# Altium schematic sheet SLT3-PAY-1Q2T_P1.SchDoc: SVPXFMC Carrier 3U
size A3; CheckedBy: \; Author: G.Kasprowicz; CompanyName: ISE; DrawnBy: T.Przywozki; Organization: WUT ISE; Address1: Warsaw University of Technology; Address2: Nowowiejska 15/19 00-665 Warsaw; Revision: 1.0.; SheetNumber: 13; SheetTotal: 20; Project: SVPXFMC Carrier 3U; ModifiedBy: -; CheckedDate: -; Title2: SpaceVPX P1, SLT3-PAY-1Q2T; DivGrp: ISE; Designer: G. Kasprowicz
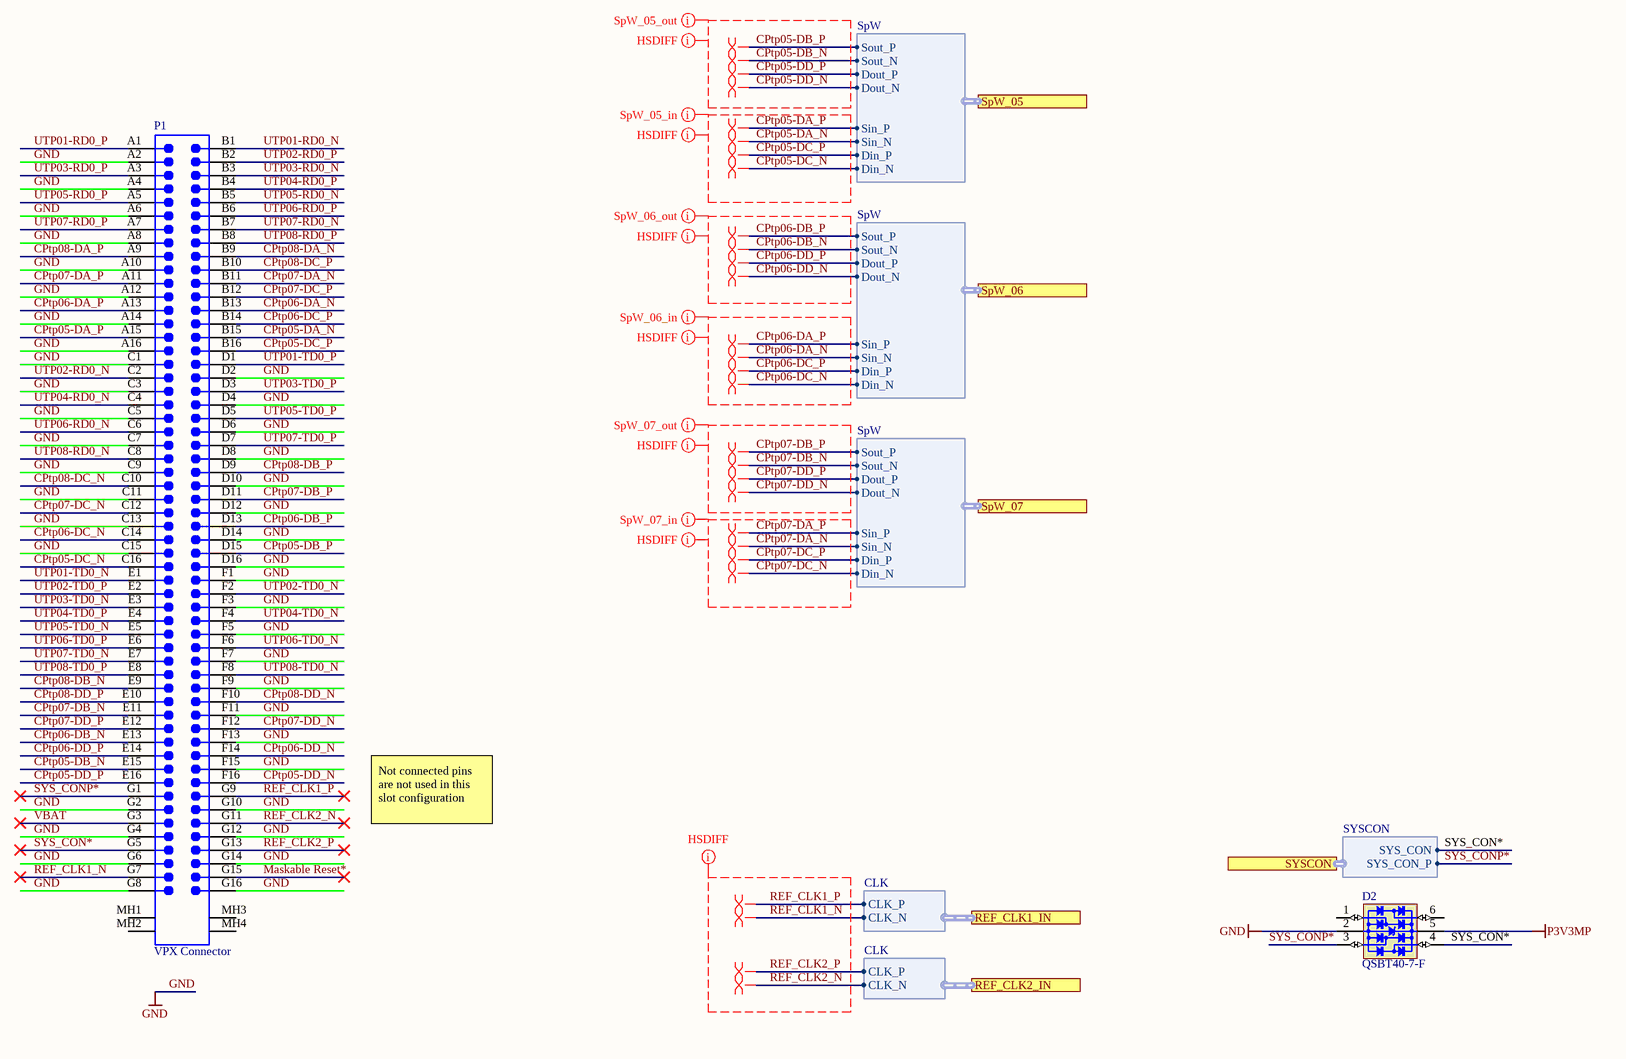
[diagram p0: SLT3-PAY-1Q2T_P1.SchDoc]

## Parts
D2  QSBT40-7-F  [SOT65P210X110-6N]
P1  VPX Connector  [BTB1-8-4H112M]

## Ports
REF_CLK1_IN (harness CLK), REF_CLK2_IN (harness CLK), SpW_05 (harness SpW), SpW_06 (harness SpW), SpW_07 (harness SpW), SYSCON (harness SYSCON)

## Harnesses
SpW: Sout_P, Sout_N, Dout_P, Dout_N, Sin_P, Sin_N, Din_P, Din_N
CLK: CLK_P, CLK_N
SYSCON: SYS_CON, SYS_CON_P

## Nets
GND: D2.2(GND) P1.A2 P1.A4 P1.A6 P1.A8 P1.A10 P1.A12 P1.A14 P1.A16 P1.C1 P1.C3 P1.C5 P1.C7 P1.C9 P1.C11 P1.C13 P1.C15 P1.D2 P1.D4 P1.D6 P1.D8 P1.D10 P1.D12 P1.D14 P1.D16 P1.F1 P1.F3 P1.F5 P1.F7 P1.F9 P1.F11 P1.F13 P1.F15 P1.G2 P1.G4 P1.G6 P1.G8 P1.G10 P1.G12 P1.G14 P1.G16
P3V3MP: D2.5(VBUS)
CPtp05-DA_N: P1.B15 ; port SpW_05.Sin_N
CPtp05-DA_P: P1.A15 ; port SpW_05.Sin_P
CPtp05-DB_N: P1.E15 ; port SpW_05.Sout_N
CPtp05-DB_P: P1.D15 ; port SpW_05.Sout_P
CPtp05-DC_N: P1.C16 ; port SpW_05.Din_N
CPtp05-DC_P: P1.B16 ; port SpW_05.Din_P
CPtp05-DD_N: P1.F16 ; port SpW_05.Dout_N
CPtp05-DD_P: P1.E16 ; port SpW_05.Dout_P
CPtp06-DA_N: P1.B13 ; port SpW_06.Sin_N
CPtp06-DA_P: P1.A13 ; port SpW_06.Sin_P
CPtp06-DB_N: P1.E13 ; port SpW_06.Sout_N
CPtp06-DB_P: P1.D13 ; port SpW_06.Sout_P
CPtp06-DC_N: P1.C14 ; port SpW_06.Din_N
CPtp06-DC_P: P1.B14 ; port SpW_06.Din_P
CPtp06-DD_N: P1.F14 ; port SpW_06.Dout_N
CPtp06-DD_P: P1.E14 ; port SpW_06.Dout_P
CPtp07-DA_N: P1.B11 ; port SpW_07.Sin_N
CPtp07-DA_P: P1.A11 ; port SpW_07.Sin_P
CPtp07-DB_N: P1.E11 ; port SpW_07.Sout_N
CPtp07-DB_P: P1.D11 ; port SpW_07.Sout_P
CPtp07-DC_N: P1.C12 ; port SpW_07.Din_N
CPtp07-DC_P: P1.B12 ; port SpW_07.Din_P
CPtp07-DD_N: P1.F12 ; port SpW_07.Dout_N
CPtp07-DD_P: P1.E12 ; port SpW_07.Dout_P
CPtp08-DA_N: P1.B9
CPtp08-DA_P: P1.A9
CPtp08-DB_N: P1.E9
CPtp08-DB_P: P1.D9
CPtp08-DC_N: P1.C10
CPtp08-DC_P: P1.B10
CPtp08-DD_N: P1.F10
CPtp08-DD_P: P1.E10
Maskable Reset*: P1.G15
REF_CLK1_N: P1.G7 ; port REF_CLK1_IN.CLK_N
REF_CLK1_P: P1.G9 ; port REF_CLK1_IN.CLK_P
REF_CLK2_N: P1.G11 ; port REF_CLK2_IN.CLK_N
REF_CLK2_P: P1.G13 ; port REF_CLK2_IN.CLK_P
SYS_CON*: D2.4(I/O3) P1.G5 ; port SYSCON.SYS_CON
SYS_CONP*: D2.3(I/O2) P1.G1 ; port SYSCON.SYS_CON_P
UTP01-RD0_N: P1.B1
UTP01-RD0_P: P1.A1
UTP01-TD0_N: P1.E1
UTP01-TD0_P: P1.D1
UTP02-RD0_N: P1.C2
UTP02-RD0_P: P1.B2
UTP02-TD0_N: P1.F2
UTP02-TD0_P: P1.E2
UTP03-RD0_N: P1.B3
UTP03-RD0_P: P1.A3
UTP03-TD0_N: P1.E3
UTP03-TD0_P: P1.D3
UTP04-RD0_N: P1.C4
UTP04-RD0_P: P1.B4
UTP04-TD0_N: P1.F4
UTP04-TD0_P: P1.E4
UTP05-RD0_N: P1.B5
UTP05-RD0_P: P1.A5
UTP05-TD0_N: P1.E5
UTP05-TD0_P: P1.D5
UTP06-RD0_N: P1.C6
UTP06-RD0_P: P1.B6
UTP06-TD0_N: P1.F6
UTP06-TD0_P: P1.E6
UTP07-RD0_N: P1.B7
UTP07-RD0_P: P1.A7
UTP07-TD0_N: P1.E7
UTP07-TD0_P: P1.D7
UTP08-RD0_N: P1.C8
UTP08-RD0_P: P1.B8
UTP08-TD0_N: P1.F8
UTP08-TD0_P: P1.E8
VBAT: P1.G3

Not connected (* = marked no-connect by the designer): D2 1(I/O1) 6(I/O4); P1 MH1 MH2 MH3 MH4

## Layout directives
differential pair: CPtp05-DA_N, CPtp05-DA_P, CPtp05-DB_N, CPtp05-DB_P, CPtp05-DC_N, CPtp05-DC_P, CPtp05-DD_N, CPtp05-DD_P, CPtp06-DA_N, CPtp06-DA_P, CPtp06-DB_N, CPtp06-DB_P, CPtp06-DC_N, CPtp06-DC_P, CPtp06-DD_N, CPtp06-DD_P, CPtp07-DA_N, CPtp07-DA_P, CPtp07-DB_N, CPtp07-DB_P, CPtp07-DC_N, CPtp07-DC_P, CPtp07-DD_N, CPtp07-DD_P, REF_CLK1_N, REF_CLK1_P, REF_CLK2_N, REF_CLK2_P
net class SpW_05_out: CPtp05-DB_N, CPtp05-DB_P, CPtp05-DD_N, CPtp05-DD_P
net class SpW_05_in: CPtp05-DA_N, CPtp05-DA_P, CPtp05-DC_N, CPtp05-DC_P
net class SpW_06_out: CPtp06-DB_N, CPtp06-DB_P, CPtp06-DD_N, CPtp06-DD_P
net class SpW_06_in: CPtp06-DA_N, CPtp06-DA_P, CPtp06-DC_N, CPtp06-DC_P
net class HSDIFF: CPtp05-DA_N, CPtp05-DA_P, CPtp05-DB_N, CPtp05-DB_P, CPtp05-DC_N, CPtp05-DC_P, CPtp05-DD_N, CPtp05-DD_P, CPtp06-DA_N, CPtp06-DA_P, CPtp06-DB_N, CPtp06-DB_P, CPtp06-DC_N, CPtp06-DC_P, CPtp06-DD_N, CPtp06-DD_P, CPtp07-DA_N, CPtp07-DA_P, CPtp07-DB_N, CPtp07-DB_P, CPtp07-DC_N, CPtp07-DC_P, CPtp07-DD_N, CPtp07-DD_P, REF_CLK1_N, REF_CLK1_P, REF_CLK2_N, REF_CLK2_P
net class SpW_07_out: CPtp07-DB_N, CPtp07-DB_P, CPtp07-DD_N, CPtp07-DD_P
net class SpW_07_in: CPtp07-DA_N, CPtp07-DA_P, CPtp07-DC_N, CPtp07-DC_P

## Notes on the sheet
- Not connected pins are not used in this slot configuration
- Title
- Size:
- Date:
- A3
- Number:
- Time:
- Revision:
- Sheet
- of
- File:

## Library data of the parts
D2 = D_TVS_QSBT40-7-F: Bonding: No; PressFit: No; Case: *; Component Kind: Standard; Component Type: Standard; ComponentHeigth: *; CreateDate: 2018-01-01; Device: QSBT40-7-F; Footprint: SOT363; HelpURL: *; LatestRevisionDate: 2018-01-01; Manufacturer: *; Manufacturer Part Number: QSBT40-7-F; Mounted: Yes; PackageDescription: *; Part Description: *; Part Number: *; Pin Count: 6; Sense: No; SMD: Yes; Socket: No; Value: *
P1 = 2102771-1: Ruggedized Board-to-Board Connector, Right Angle, 7-Row, Pitch 1.8mm, 112-Position; Manufacturer: TE; Bonding: No; ComponentHeigth: 14.7mm; PressFit: No; Case: *; Component Kind: Standard; Component Type: Standard; CreateDate: 2018-01-01; Device: *; Footprint: *; HelpURL: *; LatestRevisionDate: 2018-01-01; Manufacturer Part Number: 2102771-1; Mounted: Yes; PackageDescription: 2102771-1; Part Description: Ruggedized Board-to-Board Connector, Right Angle, 7-Row, Pitch 1.8mm, 112-Position; Part Number: 2102771-1; Pin Count: *; Sense: No; SMD: Yes; Socket: No; Family: VPX Connector